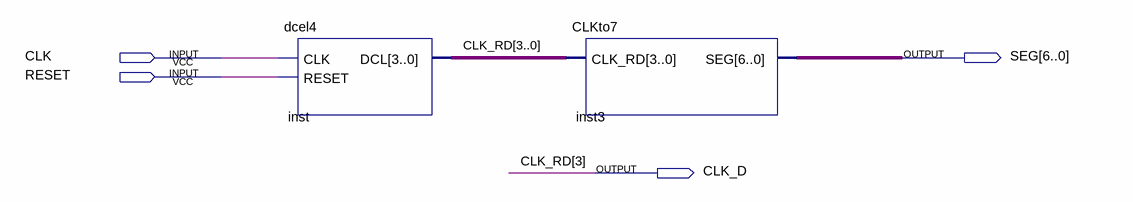
[diagram p0: schematic sheet]
// Quartus schematic dcel4_seg.bdf as structural Verilog: 2 symbols, 4 pins
module dcel4_seg (
  input  CLK,
  input  RESET,
  output [6:0] SEG,
  output CLK_D
);

  wire [2:0] CLK_RD;

  dcel4 inst (.CLK(CLK), .RESET(RESET), .DCL({CLK_D, CLK_RD}));
  CLKto7 inst3 (.CLK_RD({CLK_D, CLK_RD}), .SEG(SEG));

  // Other names for the same wires on the sheet: CLK_RD[3] = CLK_D
endmodule
